# EAGLE schematic bat-brd-rev01 (EAGLE 9.5.1)
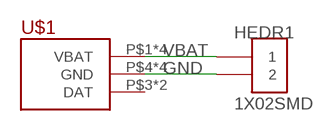
[diagram p0: schematic, sheet 1]

## Parts
HEDR1  1X02SMD  [1X2_SMD]
U$1  CON-BAT-TG-MEZ_MALE  [MEZ-DF37C-10DP]

## Nets
GND: HEDR1.2 U$1.P$4(GND) U$1.P$5(GND) U$1.P$9(GND) U$1.P$10(GND)
VBAT: HEDR1.1 U$1.P$1(VBAT) U$1.P$2(VBAT) U$1.P$6(VBAT) U$1.P$7(VBAT)
Unconnected: U$1.P$3(DAT) U$1.P$8(DAT)

## Library data of the parts
HEDR1 = 0TG-Lib v01.5:1X02
U$1 = 0TG-Lib v01.5:CON-BAT-TG-MEZ